# EasyEDA Pro project esp32-v7.epro

# Schematic Schematic1
Board Name: Board1
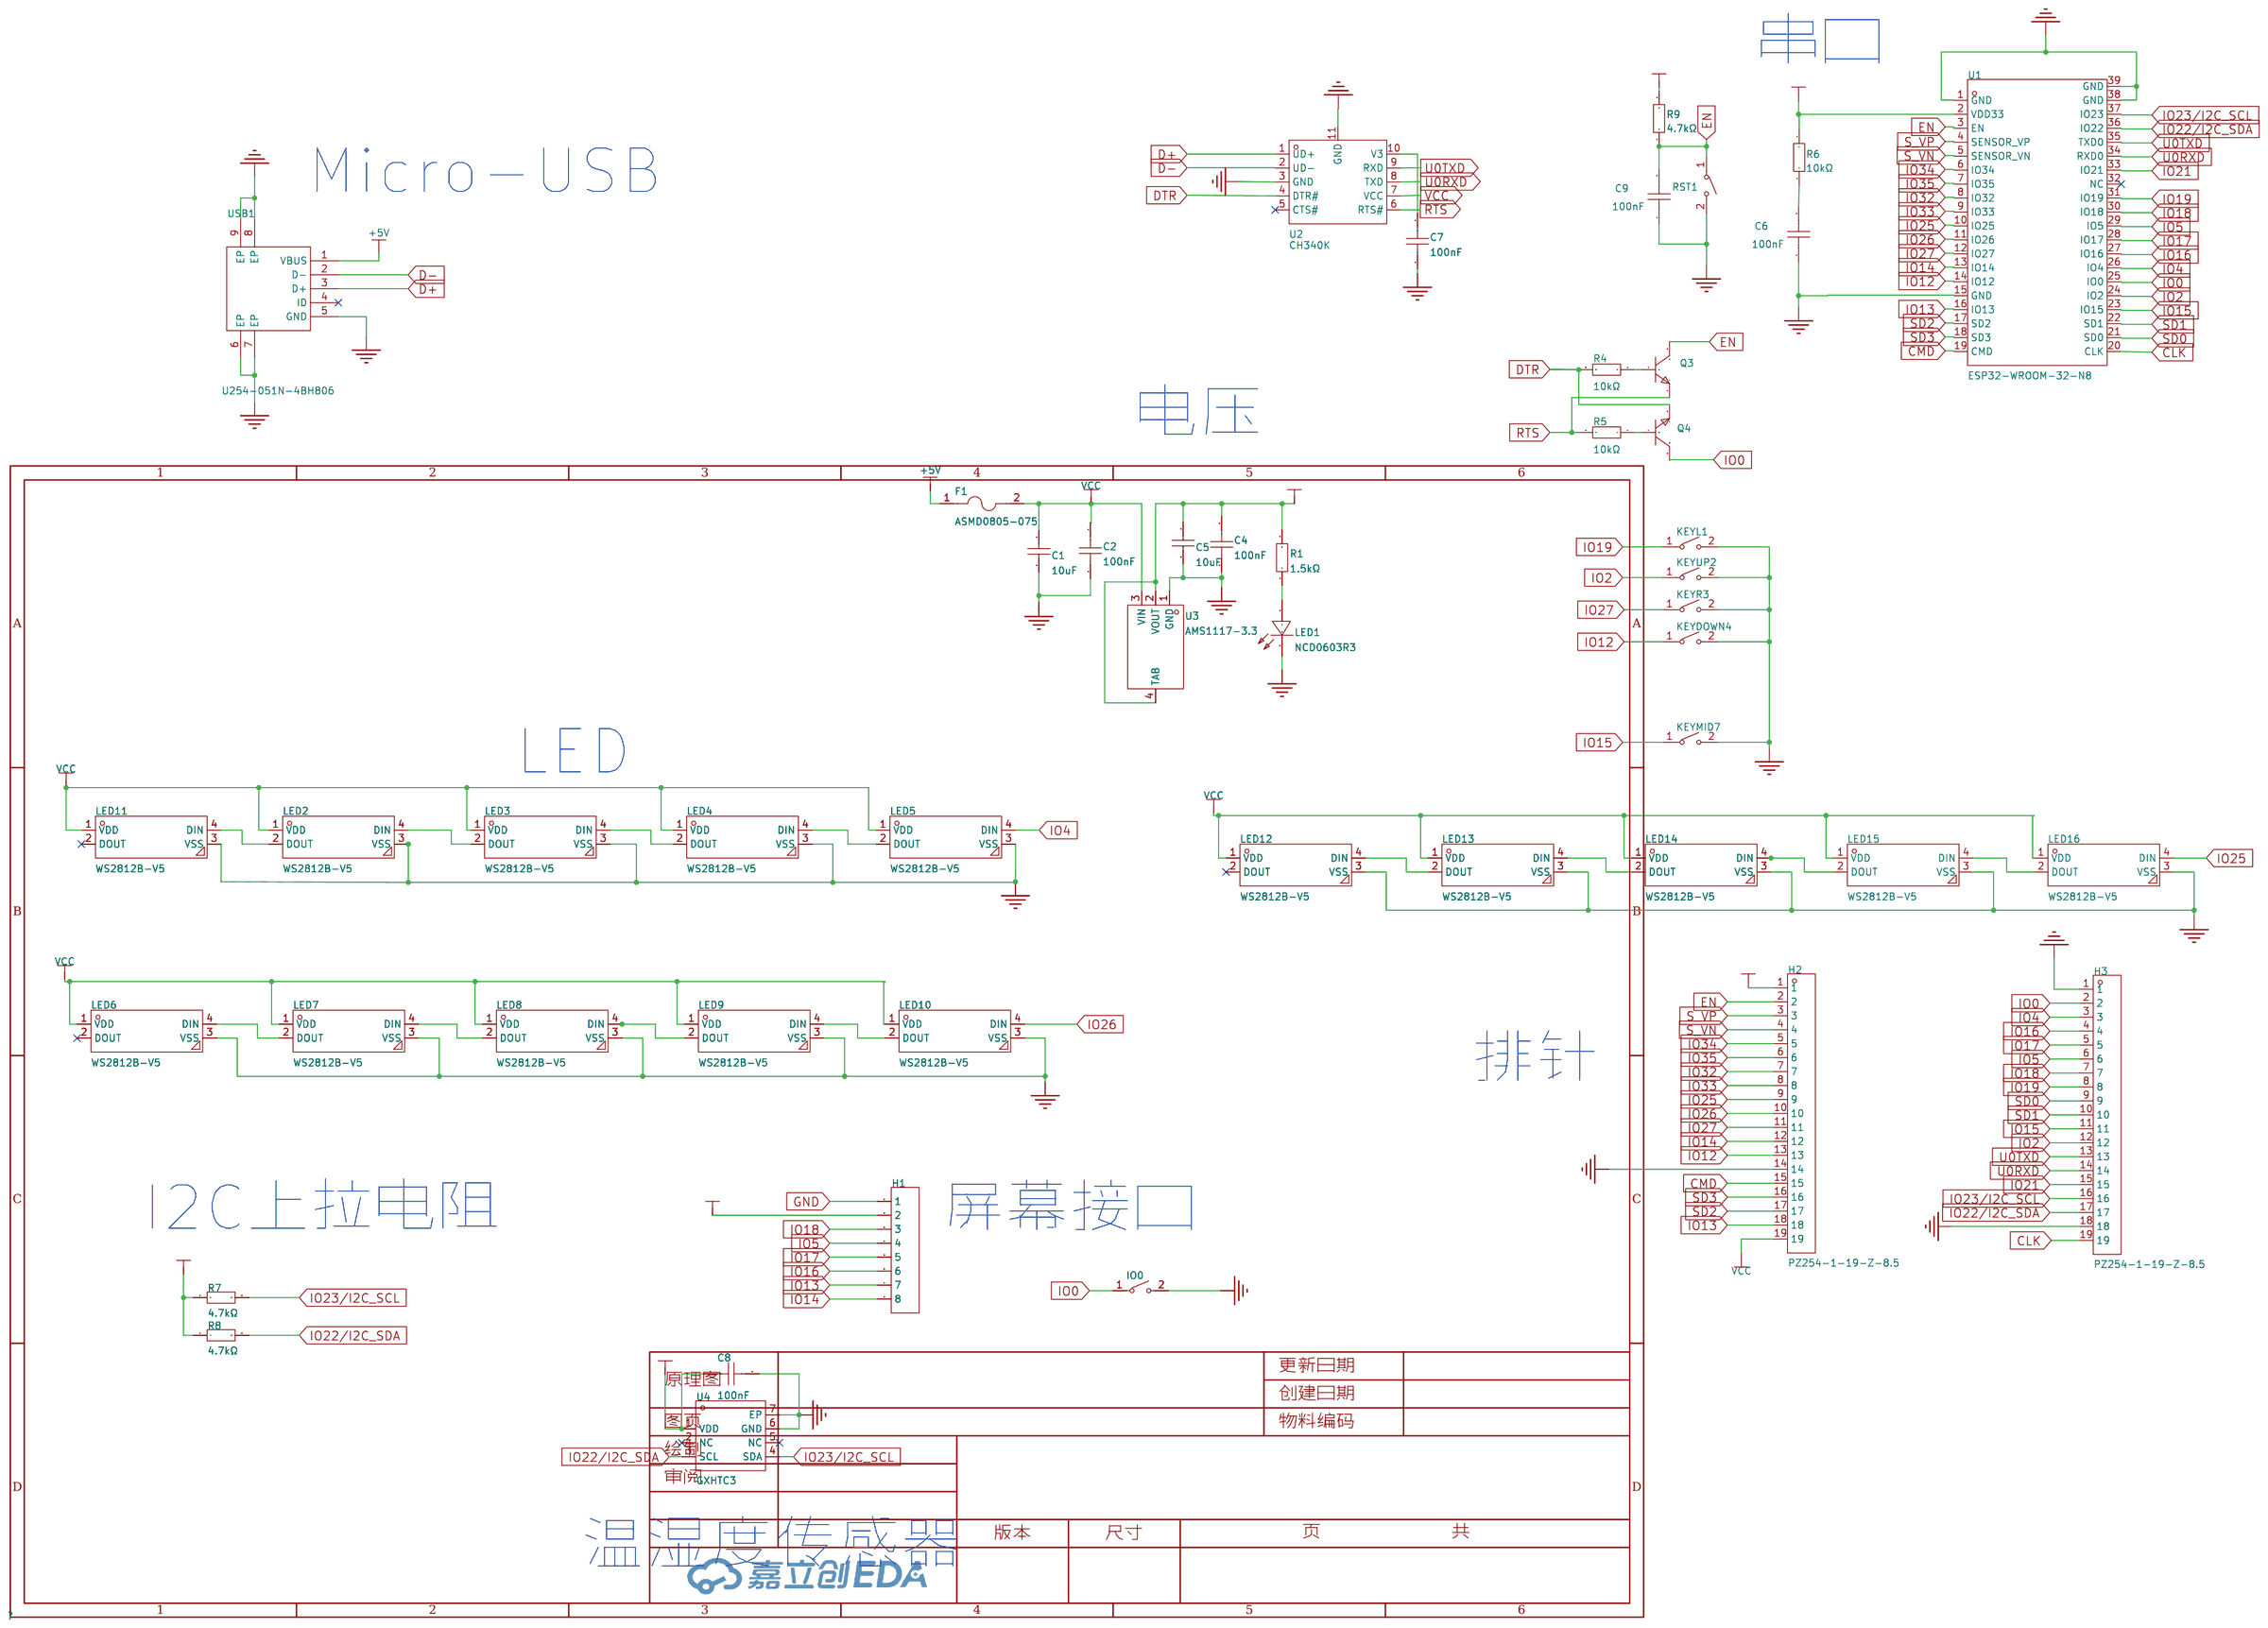
[diagram p0: schematic sheet]

## Parts
C1  10uF  [C0805]
C2  100nF  [C0603]
C4  100nF  [C0603]
C5  10uF  [C0805]
C6  100nF  [C0603]
C7  100nF  [C0603]
C8  100nF  [C0603]
C9  100nF  [C0603]
F1  ASMD0805-075  [F0805]
H1  -  [HDR-TH_8P-P2.54-V-F-1]
H2  PZ254-1-19-Z-8.5  [HDR-TH_19P-P2.54-V-M]
H3  PZ254-1-19-Z-8.5  [HDR-TH_19P-P2.54-V-M]
IO0  TS-1088R-02526  [SW-SMD_L3.9-W3.0-P4.45]
KEYDOWN4  TS-1088R-02526  [SW-SMD_L3.9-W3.0-P4.45]
KEYL1  TS-1088R-02526  [SW-SMD_L3.9-W3.0-P4.45]
KEYMID7  TS-1088R-02526  [SW-SMD_L3.9-W3.0-P4.45]
KEYR3  TS-1088R-02526  [SW-SMD_L3.9-W3.0-P4.45]
KEYUP2  TS-1088R-02526  [SW-SMD_L3.9-W3.0-P4.45]
LED1  NCD0603R3  [LED0603-R-RD_RED]
LED2  WS2812B-V5  [LED-SMD_4P-L5.0-W5.0-LS5.4-TL-1]
LED3  WS2812B-V5  [LED-SMD_4P-L5.0-W5.0-LS5.4-TL-1]
LED4  WS2812B-V5  [LED-SMD_4P-L5.0-W5.0-LS5.4-TL-1]
LED5  WS2812B-V5  [LED-SMD_4P-L5.0-W5.0-LS5.4-TL-1]
LED6  WS2812B-V5  [LED-SMD_4P-L5.0-W5.0-LS5.4-TL-1]
LED7  WS2812B-V5  [LED-SMD_4P-L5.0-W5.0-LS5.4-TL-1]
LED8  WS2812B-V5  [LED-SMD_4P-L5.0-W5.0-LS5.4-TL-1]
LED9  WS2812B-V5  [LED-SMD_4P-L5.0-W5.0-LS5.4-TL-1]
LED10  WS2812B-V5  [LED-SMD_4P-L5.0-W5.0-LS5.4-TL-1]
LED11  WS2812B-V5  [LED-SMD_4P-L5.0-W5.0-LS5.4-TL-1]
LED12  WS2812B-V5  [LED-SMD_4P-L5.0-W5.0-LS5.4-TL-1]
LED13  WS2812B-V5  [LED-SMD_4P-L5.0-W5.0-LS5.4-TL-1]
LED14  WS2812B-V5  [LED-SMD_4P-L5.0-W5.0-LS5.4-TL-1]
LED15  WS2812B-V5  [LED-SMD_4P-L5.0-W5.0-LS5.4-TL-1]
LED16  WS2812B-V5  [LED-SMD_4P-L5.0-W5.0-LS5.4-TL-1]
Q3  L8050QLT1G  [SOT-23-3_L2.9-W1.3-P1.90-LS2.4-BR]
Q4  L8050QLT1G  [SOT-23-3_L2.9-W1.3-P1.90-LS2.4-BR]
R1  1.5kΩ  [R0805]
R4  10kΩ  [R0603]
R5  10kΩ  [R0603]
R6  10kΩ  [R0603]
R7  4.7kΩ  [R0805]
R8  4.7kΩ  [R0805]
R9  4.7kΩ  [R0805]
RST1  TS-1088R-02526  [SW-SMD_L3.9-W3.0-P4.45]
U1  ESP32-WROOM-32-N8  [WIFIM-SMD_39P-L25.5-W18.0-P1.27]
U2  CH340K  [ESOP-10_L4.9-W3.9-P1.00-LS6.0-BL-EP]
U3  AMS1117-3.3  [SOT-223-3_L6.5-W3.4-P2.30-LS7.0-BR]
U4  GXHTC3  [DFN-6_L2.0-W2.0-P0.50-BL-EP]
USB1  U254-051N-4BH806  [MICRO-USB-SMD_U254-051N-4BH806]

## Library data of the parts
C1 C5 = CL21A106KOQNNNE: 容值:10uF;精度:±10%;额定电压:16V;材质(温度系数):X5R;; LCSC Part Name: 10uF ±10% 16V; Supplier Part: C1713; Manufacturer: SAMSUNG(三星); Supplier Footprint: 0805; JLCPCB Part Class: 扩展库; Datasheet: https://atta.szlcsc.com/upload/public/pdf/source/20160218/1457707763339.pdf; Supplier: LCSC; Tolerance: ±10%; Voltage Rated: 16V; Temperature Coefficient: X5R; Check: true
C2 C4 C6-C9 = CC0603KRX7R9BB104: 容值:100nF;精度:±10%;额定电压:50V;材质(温度系数):X7R;; LCSC Part Name: 100nF ±10% 50V; Supplier Part: C14663; Manufacturer: YAGEO(国巨); Supplier Footprint: 0603; JLCPCB Part Class: 基础库; Datasheet: https://atta.szlcsc.com/upload/public/pdf/source/20180910/C282072_33301C7F631E79921B82A8DAC6BCC5B3.pdf; Supplier: LCSC; Tolerance: ±10%; Voltage Rated: 50V; Temperature Coefficient: X7R; Check: true
F1 = ASMD0805-075: 最大电压:6V;最大电流:40A;保持电流:750mA;跳闸电流:1.5A;; LCSC Part Name: 6V 750mA 0805自恢复; Supplier Part: C135330; Manufacturer: JDTfuse(集电通); Supplier Footprint: 0805; JLCPCB Part Class: 扩展库; Datasheet: https://atta.szlcsc.com/upload/public/pdf/source/20230515/CC6FBEFAAD08EE936C05ACEA13E8EAD9.pdf; Supplier: LCSC; Operating Voltage (Max): 6V; Current Rating (Max): 40A; Hold Current: 750mA; Trip Current: 1.5A; Power Dissipation: 600mW; Resistance - Initial (Ri) (Min): 90mΩ; Resistance - Post Trip (R1) (Max): 385mΩ; Maximum Time to Trip: 200ms; Operating Temperature: -40℃~+85℃; Check: true
H1 = HDR-F_2.54_1x8P: Supplier Part: C27438; Supplier Footprint: 插件; JLCPCB Part Class: 扩展库; Check: true
H2 H3 = PZ254-1-19-Z-8.5_C2894942: 插针结构:1x19P;间距:2.54mm;行距:-;圆针/方针:方针;安装类型:直插;排数:单排;总PIN位数:19P;额定电流:3A;额定电压:-;配合针长度:6mm;塑高:2.5mm;端接针长度:3mm;触头材质:黄铜;工作温度范围:-40℃~+105℃;焊接温度(最大值):260℃@10S;颜色:黑色;; LCSC Part Name: 1x19P 间距:2.54mm 方针 直插; Supplier Part: C2894942; Manufacturer: HCTL(华灿天禄); Supplier Footprint: 插件,P=2.54mm; JLCPCB Part Class: 扩展库; Datasheet: https://atta.szlcsc.com/upload/public/pdf/source/20240305/0F0A2A5C422E5D195558C9C26715A031.pdf; Supplier: LCSC; Pin Structure: 1x19P; Pitch: 2.54mm; Circluar Pins/Square Pins: 方针; Mounting Type: 直插; Number of Rows: 单排; Number of Pins: 19P; Current Rating (Max): 3A; Length of Mating Pin: 6mm; Insulation Height: 2.5mm; Length of End Connection Pin: 3mm; Contact Material: 黄铜; Operating Temperature Range: -40℃~+105℃; Soldering Temperature(Max): 260℃@10S; Color: 黑色; Check: true
IO0 KEYDOWN4 KEYL1 KEYMID7 KEYR3 KEYUP2 RST1 = TS-1088R-02526: 电路结构:单刀单掷;按钮形状:圆形按钮;安装方式:立贴;开关长度:3.9mm;开关宽度:2.93mm;开关高度:2.5mm;触点电流:50mA;额定电压(DC):12V;带灯:-;机械寿命:-;; LCSC Part Name: 3.9*2.93*2.5mm 立贴 轻触开关; Supplier Part: C455281; Manufacturer: XUNPU(讯普); Supplier Footprint: SMD,3x4mm; JLCPCB Part Class: 扩展库; Datasheet: https://atta.szlcsc.com/upload/public/pdf/source/20191118/C455281_EC5379764BC1462550DF64BBBFEA9579.pdf; Supplier: LCSC; Circuit: 单刀单掷; Actuator Style: 圆形按钮; Mounting Style: 立贴; Switch Length: 3.9mm; Switch Width: 2.93mm; Switch Height: 2.5mm; Contact Current: 50mA; Voltage Rating (DC): 12V; Check: true
LED1 = NCD0603R3: 发光颜色:红色;正向电压(VF):1.6V~2.6V;功率:65mW;正向电流:25mA;主波长:620nm~640nm;透镜颜色:无色透明透镜;发光强度:51mcd~150mcd;发光角度:130°;工作温度:-30℃~+85℃;; Supplier Part: C3151730; Manufacturer: 国星光电; Supplier Footprint: 0603; JLCPCB Part Class: 扩展库; Datasheet: https://atta.szlcsc.com/upload/public/pdf/source/20220704/CBFF28C1847A97213A75929E60B7DDE7.pdf; Supplier: LCSC; Emitted Color: 红色; Forward Voltage (VF): 1.6V~2.6V; Power Dissipation: 65mW; Forward Current: 25mA; Dominant Wavelength: 620nm~640nm; Peak Wavelength: 640nm; Lens Color: 无色透明透镜; Luminous Intensity: 51mcd~150mcd; Viewing Angle: 130°; Operating Temperature: -30℃~+85℃; Check: true
LED2-LED16 = WS2812B-V5_C2846931: （注意防潮，请查阅规格书中对应具体内容）; Supplier Part: C2846931; Manufacturer: worldsemi; Supplier Footprint: SMD5050; JLCPCB Part Class: 扩展库; Datasheet: https://atta.szlcsc.com/upload/public/pdf/source/20211224/E1D51490BF3990BC3747CA833459C67A.pdf; Supplier: LCSC; Check: true
Q3 Q4 = L8050QLT1G: 晶体管类型:NPN;集电极电流(Ic):800mA;集射极击穿电压(Vceo):25V;功率(Pd):225mW;; LCSC Part Name: 耐压:25V 电流:800mA NPN; Supplier Part: C49581; Manufacturer: LRC(乐山无线电); Supplier Footprint: SOT-23; JLCPCB Part Class: 扩展库; Datasheet: https://atta.szlcsc.com/upload/public/pdf/source/20150518/1457707314424.pdf; Supplier: LCSC; Transistor Type: NPN; Collector Current (Ic): 800mA; Collector-Emitter Breakdown Voltage (Vceo): 25V; Power Dissipation (Pd): 225mW; Check: true
R1 = 0805W8F1501T5E: 电阻类型:厚膜电阻;阻值:1.5kΩ;精度:±1%;功率:125mW;最大工作电压:150V;温度系数:±100ppm/℃;; LCSC Part Name: 1.5kΩ ±1% 125mW 厚膜电阻; Supplier Part: C4310; Manufacturer: UNI-ROYAL(厚声); Supplier Footprint: 0805; JLCPCB Part Class: 基础库; Datasheet: https://atta.szlcsc.com/upload/public/pdf/source/20200306/C422600_1E6D84923E4A46A82E41ADD87F860B5C.pdf; Supplier: LCSC; Type: 厚膜电阻; Tolerance: ±1%; Power(Watts): 125mW; Overload Voltage (Max): 150V; Temperature Coefficient: ±100ppm/℃; Operating Temperature Range: -55℃~+155℃; Check: true
R4-R6 = TR0603B10K0P0525Z: 电阻类型:薄膜电阻;阻值:10kΩ;精度:±0.1%;功率:100mW;温度系数:±25ppm/;最大工作电压:75V;工作温度范围:-55~+155;; LCSC Part Name: 10kΩ ±0.1% 100mW; Supplier Part: C188363; Manufacturer: EVER OHMS(天二科技); Supplier Footprint: 0603; JLCPCB Part Class: Extended Part; Datasheet: https://atta.szlcsc.com/upload/public/pdf/source/20190415/C188363_433BF05B6FB8F7A0F5F35A3E4390C55A.pdf; Supplier: LCSC; Type: 薄膜电阻; Tolerance: ±0.1%; Power(Watts): 100mW; Temperature Coefficient: ±25ppm/; Overload Voltage (Max): 75V; Operating Temperature Range: -55~+155; Check: true
R7-R9 = 0805W8F4701T5E: 电阻类型:厚膜电阻;阻值:4.7kΩ;精度:±1%;功率:125mW;最大工作电压:150V;温度系数:±100ppm/℃;; LCSC Part Name: 4.7kΩ ±1% 125mW 厚膜电阻; Supplier Part: C17673; Manufacturer: UNI-ROYAL(厚声); Supplier Footprint: 0805; JLCPCB Part Class: 基础库; Datasheet: https://atta.szlcsc.com/upload/public/pdf/source/20200306/C422600_1E6D84923E4A46A82E41ADD87F860B5C.pdf; Supplier: LCSC; Type: 厚膜电阻; Tolerance: ±1%; Power(Watts): 125mW; Overload Voltage (Max): 150V; Temperature Coefficient: ±100ppm/℃; Operating Temperature Range: -55℃~+155℃; Check: true
U1 = ESP32-WROOM-32-N8: Supplier Part: C529582; Manufacturer: ESPRESSIF(乐鑫); Supplier Footprint: SMD,18x25.5mm; JLCPCB Part Class: 扩展库; Datasheet: https://atta.szlcsc.com/upload/public/pdf/source/20200521/C529581_8F7B9F041ADB7CF235FBC8D159B9C4FF.pdf; Supplier: LCSC; Check: true
U2 = CH340K_C18208922: LCSC Part Name: CH340K 人工转编带; Supplier Part: C18208922; Manufacturer: WCH(南京沁恒); Supplier Footprint: ESSOP-10-150mil-1mm; JLCPCB Part Class: 扩展库; Datasheet: https://atta.szlcsc.com/upload/public/pdf/source/20240313/9D833A30DDFD16C064A7ADE10A944019.pdf; Supplier: LCSC; Check: true
U3 = AMS1117-3.3_C351784: 输出类型:固定;最大输入电压:18V;输出电压:3.3V;最大输出电流:800mA;电源纹波抑制比(PSRR):-;输出极性:正极;; LCSC Part Name: 输入18V 输出3.3V 800mA; Supplier Part: C351784; Manufacturer: PUOLOP(迪浦); Supplier Footprint: SOT-223-3; JLCPCB Part Class: 扩展库; Datasheet: https://atta.szlcsc.com/upload/public/pdf/source/20210915/EA806799CEEC3F52E0A4FA8303A508AC.pdf; Supplier: LCSC; Output Type: 固定; Maximum Input Voltage: 18V; Output Voltage: 3.3V; MAX Output Current: 800mA; Dropout Voltage: 1.4V@(1A); Output Polarity: 正极; Number of Outputs: 1; Check: true
U4 = GXHTC3: GXHTC3C是一款为消费电子应用领域设计的温湿度传感器芯片。它在封装体积、功耗、供电电压范围和性价比方面完全满足消费电子领域需求。GXHTC3在单颗芯片上实现了完整的温湿度传感器系统，包括电容式湿敏传感单元，PN 结测温单元，16位 ADC，数字信号处理电路，校准数据存储单元和I2C数字通信接口电路。; Supplier Part: C2837688; Manufacturer: GXCAS(中科银河芯); Supplier Footprint: DFN-6-EP(2x2); JLCPCB Part Class: 扩展库; Datasheet: https://atta.szlcsc.com/upload/public/pdf/source/20230809/660E95CE3850F3D94BCF8D6A95359493.pdf; Supplier: LCSC; Check: true
USB1 = U254-051N-4BH806: 连接器类型:Micro-B;标准:USB 2.0;公母:母;端口数量:1;触点数量:5P;安装方式:卧贴;额定电流 - 电源:1A;触头材质:铜合金;触头镀层:金;工作温度范围:-40℃~+85℃;焊接温度(最大值):260℃;; LCSC Part Name: Micro-B 母 卧贴; Supplier Part: C319170; Manufacturer: XKB Connectivity(中国星坤); Supplier Footprint: SMD; JLCPCB Part Class: 扩展库; Datasheet: https://atta.szlcsc.com/upload/public/pdf/source/20200227/C319170_F6FB71A4890E6895B9081D2D7B14A58F.pdf; Supplier: LCSC; Connector Type: Micro-B; Standard: USB 2.0; Gender: 母; Number of Ports: 1; Number of Contacts: 5P; Mounting Style: 卧贴; Current Rating - Power (Max): 1A; Contact Material: 铜合金; Contact Plating: 金; Operating Temperature Range: -40℃~+85℃; Soldering Temperature(Max): 260℃

## Nets
3V3: C4.2 C5.2 C8.2 H1.2 H2.1 R1.2 R6.1 R7.1 R8.1 R9.2 U1.2(VDD33) U3.2(VOUT) U3.4(TAB) U4.1(VDD)
+5V: F1.1 USB1.1(VBUS)
GND: C1.1 C2.1 C4.1 C5.1 C6.1 C7.1 C8.1 C9.1 H1.1 H2.14 H3.1 H3.18 IO0.2 KEYDOWN4.2 KEYL1.2 KEYMID7.2 KEYR3.2 KEYUP2.2 LED1.2(K) LED2.3(VSS) LED3.3(VSS) LED4.3(VSS) LED5.3(VSS) LED6.3(VSS) LED7.3(VSS) LED8.3(VSS) LED9.3(VSS) LED10.3(VSS) LED11.3(VSS) LED12.3(VSS) LED13.3(VSS) LED14.3(VSS) LED15.3(VSS) LED16.3(VSS) RST1.2 U1.15(GND) U1.39(GND) U2.3(GND) U2.11(GND) U3.1(GND) U4.6(GND) U4.7(EP) USB1.5(GND) USB1.6(EP) USB1.7(EP) USB1.8(EP) USB1.9(EP)
VCC: C1.2 C2.2 F1.2 H2.19 LED2.1(VDD) LED3.1(VDD) LED4.1(VDD) LED5.1(VDD) LED6.1(VDD) LED7.1(VDD) LED8.1(VDD) LED9.1(VDD) LED10.1(VDD) LED11.1(VDD) LED12.1(VDD) LED13.1(VDD) LED14.1(VDD) LED15.1(VDD) LED16.1(VDD) U2.7(VCC) U3.3(VIN)
CLK: H3.19 U1.20(CLK)
CMD: H2.15 U1.19(CMD)
D+: U2.1(UD+) USB1.3(D+)
D-: USB1.2(D-)
DTR: Q4.2(E) R4.2 U2.4(DTR#)
EN: C9.2 H2.2 Q3.3(C) R9.1 RST1.1 U1.3(EN)
IO0: H3.2 IO0.1 Q4.3(C)
IO2: H3.12 KEYUP2.1
IO4: H3.3 LED5.4(DIN)
IO5: H1.4 H3.6
IO12: H2.13 KEYDOWN4.1 U1.14(IO12)
IO13: H1.7 H2.18 U1.16(IO13)
IO14: H1.8 H2.12 U1.13(IO14)
IO15: H3.11 KEYMID7.1
IO16: H1.6 H3.4
IO17: H1.5 H3.5
IO18: H1.3 H3.7
IO19: H3.8 KEYL1.1
IO21: H3.15
IO22/I2C_SDA: H3.17 R8.2 U4.3(SCL)
IO23/I2C_SCL: H3.16 R7.2 U4.4(SDA)
IO25: H2.9 LED16.4(DIN) U1.10(IO25)
IO26: H2.10 LED10.4(DIN) U1.11(IO26)
IO27: H2.11 KEYR3.1 U1.12(IO27)
IO32: H2.7 U1.8(IO32)
IO33: H2.8 U1.9(IO33)
IO34: H2.5 U1.6(IO34)
IO35: H2.6 U1.7(IO35)
RTS: Q3.2(E) R5.2 U2.6(RTS#)
S_VN: H2.4 U1.5(SENSOR_VN)
S_VP: H2.3 U1.4(SENSOR_VP)
SD0: H3.9
SD1: H3.10
SD2: H2.17 U1.17(SD2)
SD3: H2.16 U1.18(SD3)
U0RXD: H3.14 U2.8(TXD)
U0TXD: H3.13 U2.9(RXD)
$1N3522: Q3.1(B) R4.1
$1N3523: Q4.1(B) R5.1
$1N6190: LED4.4(DIN) LED5.2(DOUT)
$1N6194: LED3.4(DIN) LED4.2(DOUT)
$1N7224: LED2.4(DIN) LED3.2(DOUT)
$1N7332: LED6.4(DIN) LED7.2(DOUT)
$1N7339: LED7.4(DIN) LED8.2(DOUT)
$1N7349: LED8.4(DIN) LED9.2(DOUT)
$1N7358: LED9.4(DIN) LED10.2(DOUT)
$1N7583: C6.2 R6.2
$1N8343: C7.2 U2.10(V3)
$1N10653: LED1.1(A) R1.1
$1N11613: LED14.4(DIN) LED15.2(DOUT)
$1N11617: LED15.4(DIN) LED16.2(DOUT)
$1N11658: LED13.4(DIN) LED14.2(DOUT)
$1N11662: LED12.4(DIN) LED13.2(DOUT)

Not connected (* = marked no-connect by the designer): LED2 2(DOUT); LED6 2(DOUT)*; LED11 2(DOUT)* 4(DIN); LED12 2(DOUT)*; U1 1(GND) 21(SD0) 22(SD1) 23(IO15) 24(IO2) 25(IO0) 26(IO4) 27(IO16) 28(IO17) 29(IO5) 30(IO18) 31(IO19) 32(NC)* 33(IO21) 34(RXD0) 35(TXD0) 36(IO22) 37(IO23) 38(GND); U2 2(UD-) 5(CTS#)*; U4 2(NC)* 5(NC)*; USB1 4(ID)*

## Notes on the sheet
- 串口
- Micro-USB
- 电压
- LED
- 排针
- I2C上拉电阻
- 屏幕接口
- 温湿度传感器

# Board PCB1
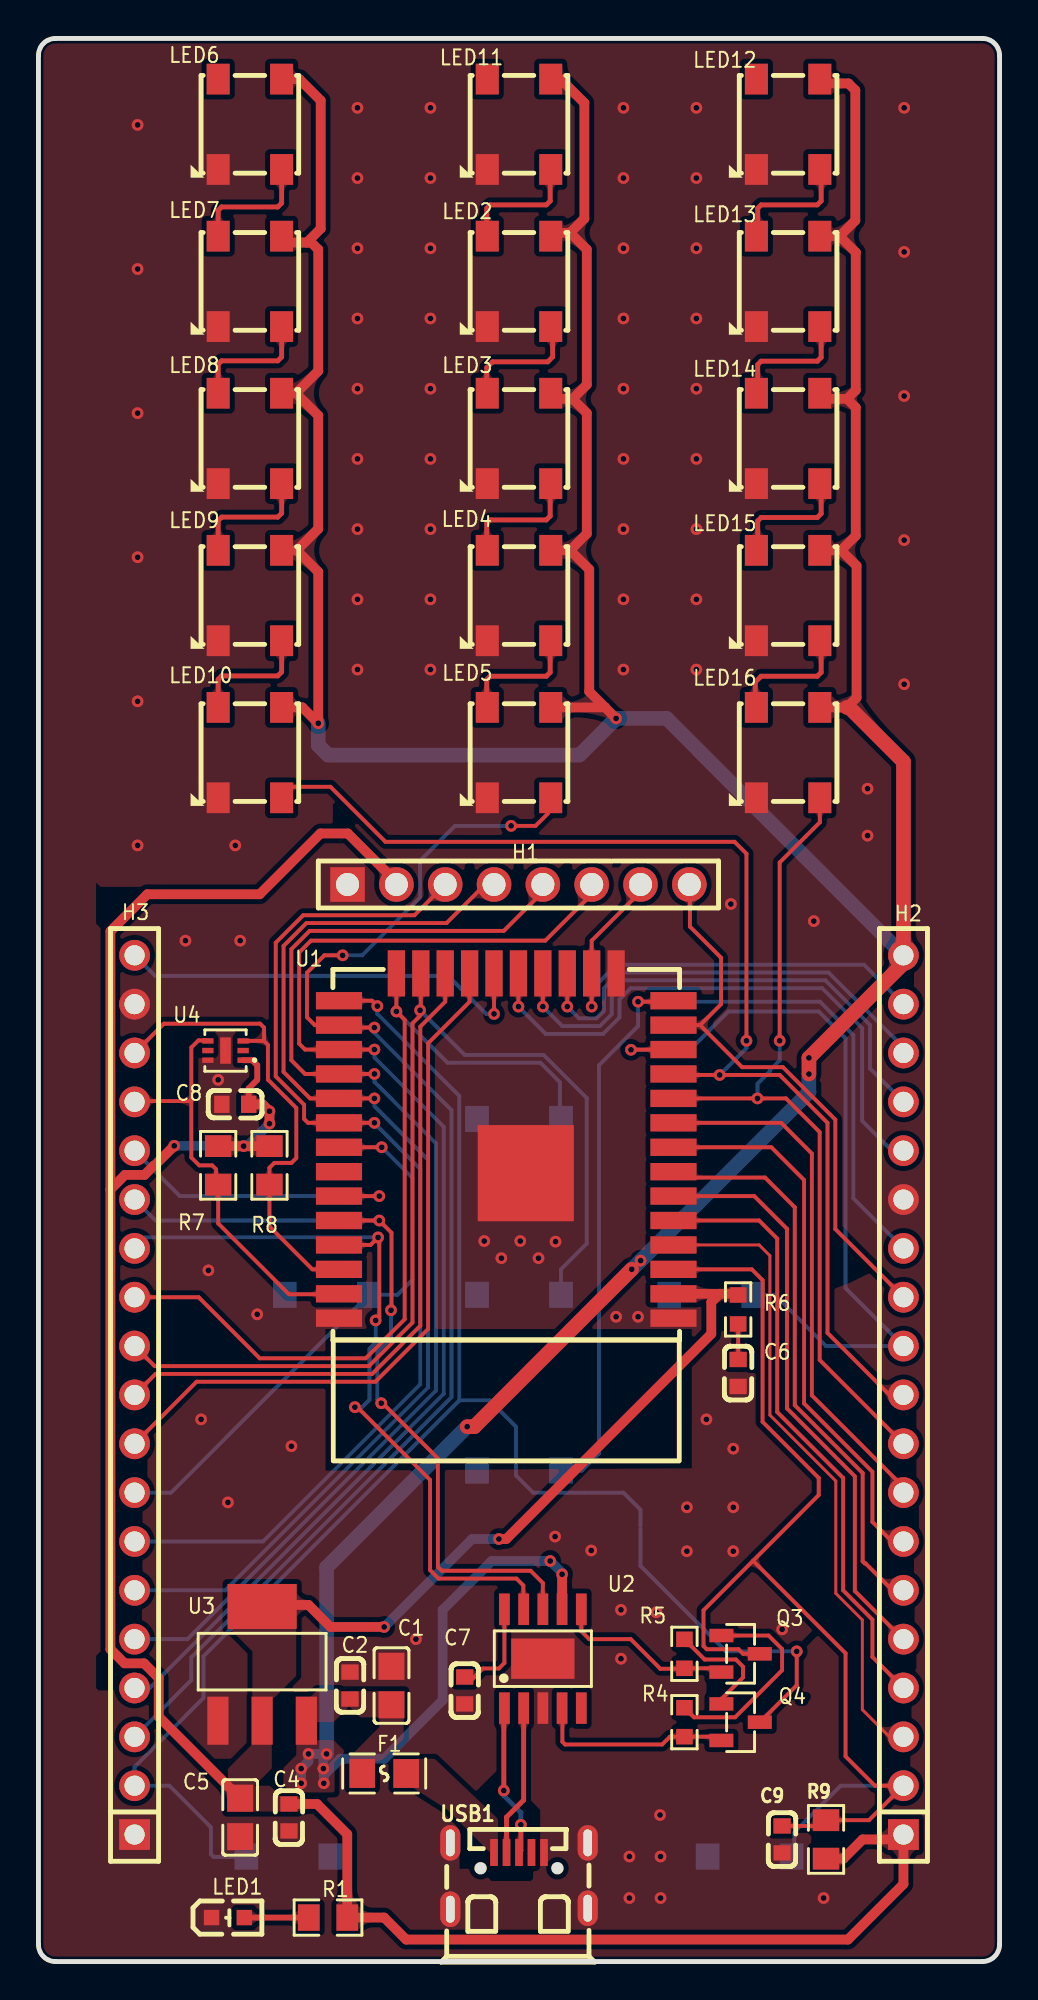
[diagram p1: board, top side]
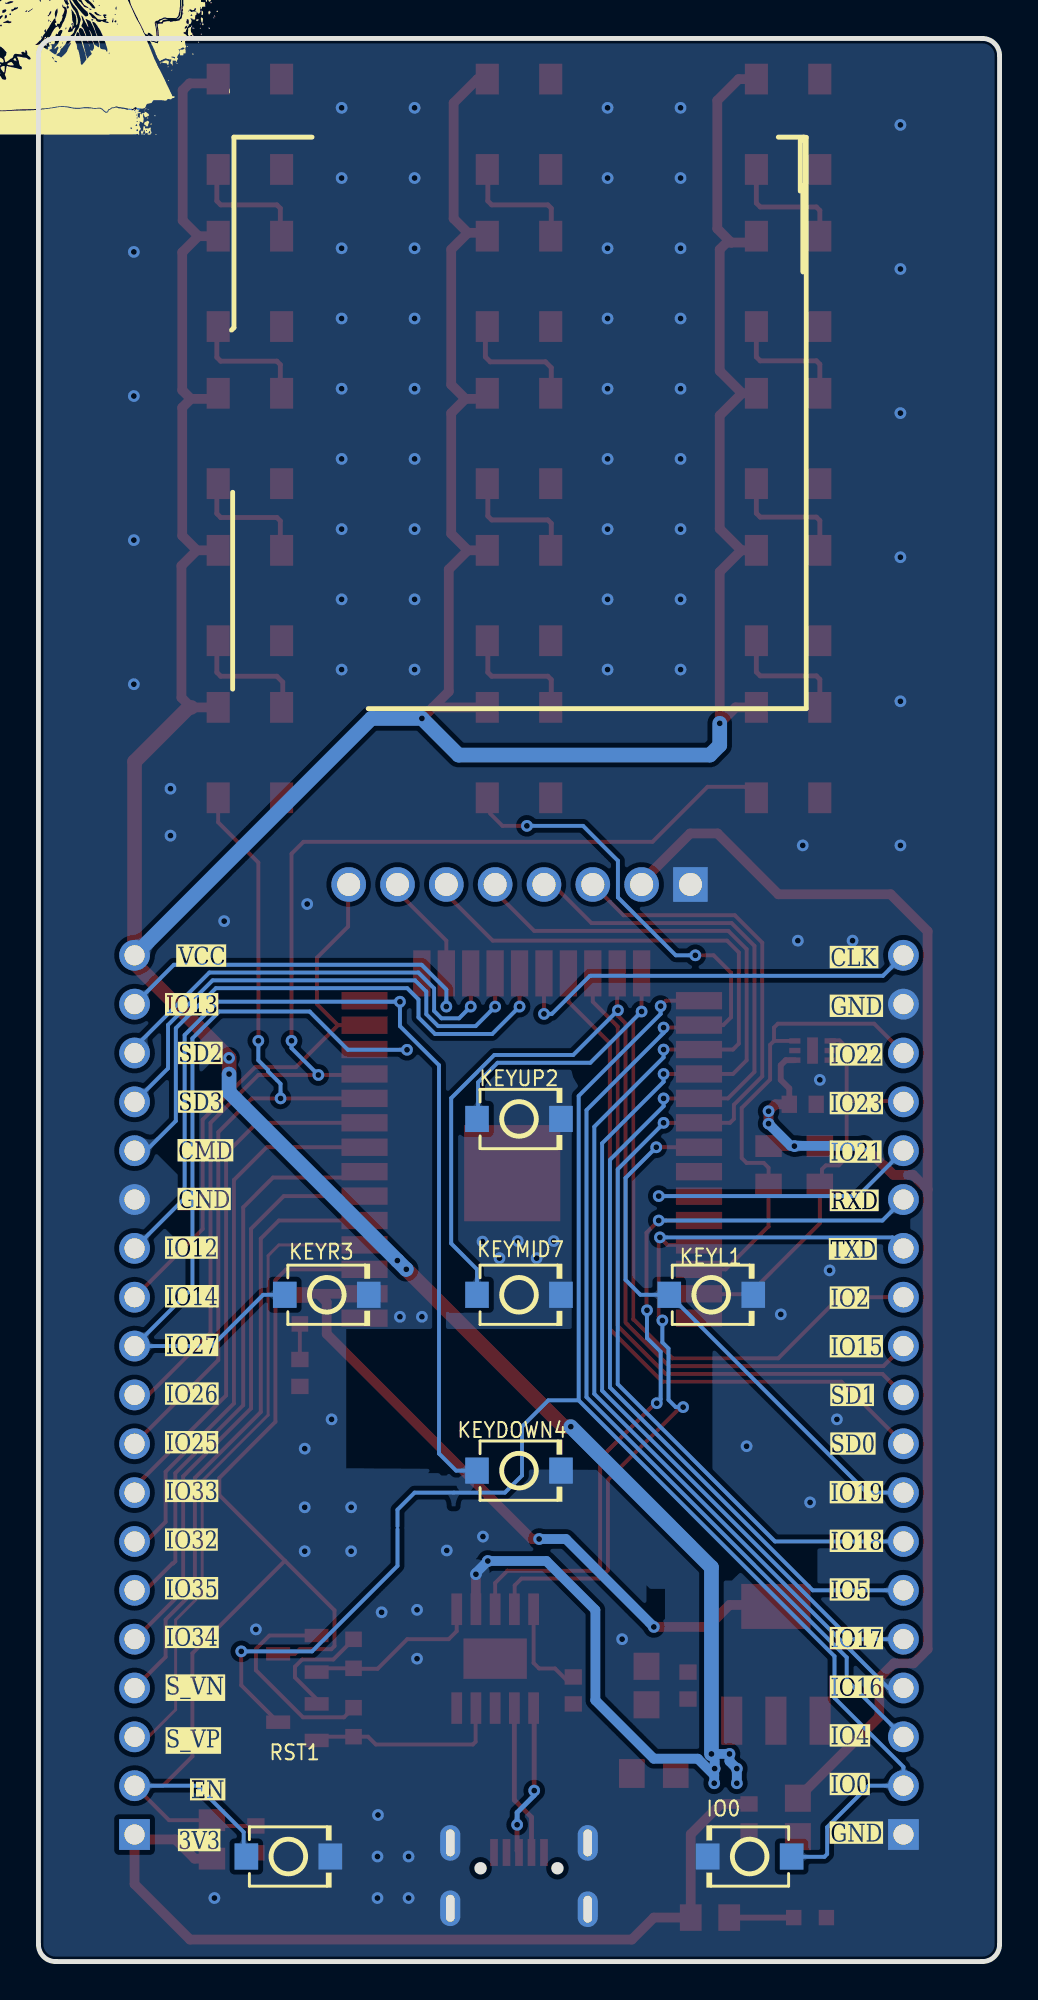
[diagram p2: board, bottom side, seen from below]

Outline 50 x 100 mm; copper layers: Top Layer, Bottom Layer. Coordinates in mm from the lower left corner of the outline.
Outline path: 0,99.11 arc(0.26,99.74) 0.89,100 49.11,100 arc(49.74,99.74) 50,99.11 50,0.89 arc(49.74,0.26) 49.11,0 0.89,0 arc(0.26,0.26) 0,0.89 0,99.11
Stack: Top Layer 0.035mm / Dielectric1 1.51mm FR4 er 4.5 / Bottom Layer 0.035mm

## Design rules (mm)
net VCC: power
net GND: power
net 3V3: power
net +5V: power
net D+: DP1
net D-: DP1
template: 自定义配置
spacing copperThickness1oz (default): track to track 0.203, other pairs 0.152 to 0.203
spacing copperThickness2oz: track to track 0.203, other pairs 0.152 to 0.3
track width copperThickness1oz (default): min 0.152, default 0.203, max 0.508
track width copperThickness2oz: min 0.203, default 0.254, max 2.54
track width power: min 0.305, default 0.508, max 0.762
differential pair differentialPair (default): width min 0.127, default 0.254, max 2.54; gap min 0.152, default 0.152
via viaSize (default): diameter min 0.61, default 0.61, max 0.61; hole min 0.305, default 0.305, max 0.305
net class power uses power
net VCC uses power
net GND uses power
net 3V3 uses power
net +5V uses power

## Placement (name value [footprint] x y rotation side)
C1  10uF  [C0805]  18.37 14.35 270 top
C2  100nF  [C0603]  16.21 14.35 270 top
C4  100nF  [C0603]  13.03 7.49 90 top
C5  10uF  [C0805]  10.49 7.49 90 top
C6  100nF  [C0603]  36.4 30.61 90 top
C7  100nF  [C0603]  22.18 14.1 90 top
C8  100nF  [C0603]  10.24 44.58 0 top
C9  100nF  [C0603]  38.69 6.35 90 top
F1  ASMD0805-075  [F0805]  17.99 9.78 180 top
H1  -  [HDR-TH_8P-P2.54-V-F-1]  24.97 56.01 0 top
H2  PZ254-1-19-Z-8.5  [HDR-TH_19P-P2.54-V-M]  45 29.46 90 top
H3  PZ254-1-19-Z-8.5  [HDR-TH_19P-P2.54-V-M]  5 29.46 90 top
IO0  TS-1088R-02526  [SW-SMD_L3.9-W3.0-P4.45]  13 5.46 0 bottom
KEYDOWN4  TS-1088R-02526  [SW-SMD_L3.9-W3.0-P4.45]  25 25.53 180 bottom
KEYL1  TS-1088R-02526  [SW-SMD_L3.9-W3.0-P4.45]  15 34.67 180 bottom
KEYMID7  TS-1088R-02526  [SW-SMD_L3.9-W3.0-P4.45]  25 34.67 180 bottom
KEYR3  TS-1088R-02526  [SW-SMD_L3.9-W3.0-P4.45]  35 34.67 180 bottom
KEYUP2  TS-1088R-02526  [SW-SMD_L3.9-W3.0-P4.45]  25 43.81 180 bottom
LED1  NCD0603R3  [LED0603-R-RD_RED]  9.86 2.29 0 top
LED2  WS2812B-V5  [LED-SMD_4P-L5.0-W5.0-LS5.4-TL-1]  25 87.37 270 top
LED3  WS2812B-V5  [LED-SMD_4P-L5.0-W5.0-LS5.4-TL-1]  25 79.2 270 top
LED4  WS2812B-V5  [LED-SMD_4P-L5.0-W5.0-LS5.4-TL-1]  25 71.03 270 top
LED5  WS2812B-V5  [LED-SMD_4P-L5.0-W5.0-LS5.4-TL-1]  25 62.86 270 top
LED6  WS2812B-V5  [LED-SMD_4P-L5.0-W5.0-LS5.4-TL-1]  11 95.54 270 top
LED7  WS2812B-V5  [LED-SMD_4P-L5.0-W5.0-LS5.4-TL-1]  11 87.37 270 top
LED8  WS2812B-V5  [LED-SMD_4P-L5.0-W5.0-LS5.4-TL-1]  11 79.2 270 top
LED9  WS2812B-V5  [LED-SMD_4P-L5.0-W5.0-LS5.4-TL-1]  11 71.03 270 top
LED10  WS2812B-V5  [LED-SMD_4P-L5.0-W5.0-LS5.4-TL-1]  11 62.86 270 top
LED11  WS2812B-V5  [LED-SMD_4P-L5.0-W5.0-LS5.4-TL-1]  25 95.54 270 top
LED12  WS2812B-V5  [LED-SMD_4P-L5.0-W5.0-LS5.4-TL-1]  39 95.54 270 top
LED13  WS2812B-V5  [LED-SMD_4P-L5.0-W5.0-LS5.4-TL-1]  39 87.37 270 top
LED14  WS2812B-V5  [LED-SMD_4P-L5.0-W5.0-LS5.4-TL-1]  39 79.2 270 top
LED15  WS2812B-V5  [LED-SMD_4P-L5.0-W5.0-LS5.4-TL-1]  39 71.03 270 top
LED16  WS2812B-V5  [LED-SMD_4P-L5.0-W5.0-LS5.4-TL-1]  39 62.86 270 top
Q3  L8050QLT1G  [SOT-23-3_L2.9-W1.3-P1.90-LS2.4-BR]  36.53 16 180 top
Q4  L8050QLT1G  [SOT-23-3_L2.9-W1.3-P1.90-LS2.4-BR]  36.53 12.45 180 top
R1  1.5kΩ  [R0805]  15.06 2.29 0 top
R4  10kΩ  [R0603]  33.61 12.45 270 top
R5  10kΩ  [R0603]  33.61 16 270 top
R6  10kΩ  [R0603]  36.4 33.91 270 top
R7  4.7kΩ  [R0805]  9.35 41.4 270 top
R8  4.7kΩ  [R0805]  12.02 41.4 270 top
R9  4.7kΩ  [R0805]  40.97 6.35 270 top
RST1  TS-1088R-02526  [SW-SMD_L3.9-W3.0-P4.45]  37 5.46 180 bottom
U1  ESP32-WROOM-32-N8  [WIFIM-SMD_39P-L25.5-W18.0-P1.27]  24.34 42.42 180 top
U2  CH340K  [ESOP-10_L4.9-W3.9-P1.00-LS6.0-BL-EP]  26.24 15.75 0 top
U3  AMS1117-3.3  [SOT-223-3_L6.5-W3.4-P2.30-LS7.0-BR]  11.64 15.49 270 top
U4  GXHTC3  [DFN-6_L2.0-W2.0-P0.50-BL-EP]  9.73 47.37 90 top
USB1  U254-051N-4BH806  [MICRO-USB-SMD_U254-051N-4BH806]  25 4.44 0 top

## Footprints (pads in the part's own frame, mm; a bottom-side part is the same pattern mirrored in y, then rotated)
C0603
  rect 0.8x0.9 smd: 1(-0.7,0) 2(0.7,0)
C0805
  rect 1.41x1.35 smd: 1(-1,0) 2(1,0)
DFN-6_L2.0-W2.0-P0.50-BL-EP
  rect 0.28x0.585 smd: 1(-0.5,-0.917) 2(0,-0.917) 3(0.5,-0.917) 4(0.5,0.917) 5(0,0.917) 6(-0.5,0.917)
  rect 1.37x0.56 smd: 7(0,0)
ESOP-10_L4.9-W3.9-P1.00-LS6.0-BL-EP
  rect 0.56x1.64 smd: 1(-2,-2.57) 2(-1,-2.57) 3(0,-2.57) 4(1,-2.57) 5(2,-2.57) 6(2,2.57) 7(1,2.57) 8(0,2.57) 9(-1,2.57) 10(-2,2.57)
  rect 3.3x2.1 smd: 11(0,0)
F0805
  rect 1.335x1.5 smd: 1(-1.143,0) 2(1.143,0)
HDR-TH_8P-P2.54-V-F-1
  rect 1.8x1.8 hole 1.2: 1(-8.89,0)
  round 1.8 hole 1.2: 2(-6.35,0) 3(-3.81,0) 4(-1.27,0) 5(1.27,0) 6(3.81,0) 7(6.35,0) 8(8.89,0)
HDR-TH_19P-P2.54-V-M
  rect 1.6x1.6 hole 1.05: 1(-22.86,0)
  round 1.6 hole 1.05: 2(-20.32,0) 3(-17.78,0) 4(-15.24,0) 5(-12.7,0) 6(-10.16,0) 7(-7.62,0) 8(-5.08,0) 9(-2.54,0) 10(0,0) 11(2.54,0) 12(5.08,0) 13(7.62,0) 14(10.16,0) 15(12.7,0) 16(15.24,0) 17(17.78,0) 18(20.32,0) 19(22.86,0)
LED0603-R-RD_RED
  rect 0.8x0.8 smd: 1(0.851,0) 2(-0.851,0)
LED-SMD_4P-L5.0-W5.0-LS5.4-TL-1
  rect 1.6x1.2 smd: 1(-2.35,1.65) 2(-2.35,-1.65) 3(2.35,-1.65) 4(2.35,1.65)
MICRO-USB-SMD_U254-051N-4BH806
  rect 0.4x1.4 smd: 1(-1.3,1.225) 2(-0.65,1.225) 3(0,1.225) 4(0.65,1.225) 5(1.3,1.225)
  oval 1.05x1.85 hole 0.45x1.4: 6(-3.575,1.725) 7(-3.575,-1.725) 8(3.575,1.725) 9(3.575,-1.675)
R0603
  rect 0.806x0.864 smd: 1(-0.753,0) 2(0.753,0)
R0805
  rect 1.133x1.377 smd: 1(-1,0) 2(1,0)
SOT-23-3_L2.9-W1.3-P1.90-LS2.4-BR
  rect 1.25x0.7 smd: 1(1,-0.95) 2(1,0.95) 3(-1,0)
SOT-223-3_L6.5-W3.4-P2.30-LS7.0-BR
  rect 2.5x1.1 smd: 1(2.97,-2.3) 2(2.97,0) 3(2.97,2.3)
  rect 2.34x3.6 smd: 4(-2.97,0)
SW-SMD_L3.9-W3.0-P4.45
  rect 1.23x1.36 smd: 1(-2.185,0) 2(2.185,0)
WIFIM-SMD_39P-L25.5-W18.0-P1.27
  rect 2.4x0.9 smd: 1(-8.7,8.965) 2(-8.7,7.695) 3(-8.7,6.425) 4(-8.7,5.155) 5(-8.7,3.885) 6(-8.7,2.615) 7(-8.7,1.345) 8(-8.7,0.075) 9(-8.7,-1.195) 10(-8.7,-2.465) 11(-8.7,-3.735) 12(-8.7,-5.005) 13(-8.7,-6.275) 14(-8.7,-7.545) 25(8.7,-7.545) 26(8.7,-6.275) 27(8.7,-5.005) 28(8.7,-3.735) 29(8.7,-2.465) 30(8.7,-1.195) 31(8.7,0.075) 32(8.7,1.345) 33(8.7,2.615) 34(8.7,3.885) 35(8.7,5.155) 36(8.7,6.425) 37(8.7,7.695) 38(8.7,8.965)
  rect 0.9x2.4 smd: 15(-5.715,-8.965) 16(-4.445,-8.965) 17(-3.175,-8.965) 18(-1.905,-8.965) 19(-0.635,-8.965) 20(0.635,-8.965) 21(1.905,-8.965) 22(3.175,-8.965) 23(4.445,-8.965) 24(5.715,-8.965)
  rect 5x5 smd: 39(-1.017,1.422)

## Nets
3V3: C4.2 C5.2 C8.2 H1.2 H2.1 R1.2 R6.1 R7.1 R8.1 R9.2 U1.2 U3.2 U3.4 U4.1
+5V: F1.1 USB1.1
GND: C1.1 C2.1 C4.1 C5.1 C6.1 C7.1 C8.1 C9.1 H1.1 H2.14 H3.1 H3.18 IO0.2 KEYDOWN4.2 KEYL1.2 KEYMID7.2 KEYR3.2 KEYUP2.2 LED1.2 LED2.3 LED3.3 LED4.3 LED5.3 LED6.3 LED7.3 LED8.3 LED9.3 LED10.3 LED11.3 LED12.3 LED13.3 LED14.3 LED15.3 LED16.3 RST1.2 U1.1 U1.15 U1.38 U1.39 U2.3 U2.11 U3.1 U4.6 U4.7 USB1.5 USB1.6 USB1.7 USB1.8 USB1.9
VCC: C1.2 C2.2 F1.2 H2.19 LED2.1 LED3.1 LED4.1 LED5.1 LED6.1 LED7.1 LED8.1 LED9.1 LED10.1 LED11.1 LED12.1 LED13.1 LED14.1 LED15.1 LED16.1 U2.7 U3.3
CLK: H3.19 U1.20
CMD: H2.15 U1.19
D+: U2.1 USB1.3
D-: U2.2 USB1.2
DTR: Q4.2 R4.2 U2.4
EN: C9.2 H2.2 Q3.3 R9.1 RST1.1 U1.3
IO0: H3.2 IO0.1 Q4.3 U1.25
IO2: H3.12 KEYUP2.1 U1.24
IO4: H3.3 LED5.4 U1.26
IO5: H1.4 H3.6 U1.29
IO12: H2.13 KEYDOWN4.1 U1.14
IO13: H1.7 H2.18 U1.16
IO14: H1.8 H2.12 U1.13
IO15: H3.11 KEYMID7.1 U1.23
IO16: H1.6 H3.4 U1.27
IO17: H1.5 H3.5 U1.28
IO18: H1.3 H3.7 U1.30
IO19: H3.8 KEYL1.1 U1.31
IO21: H3.15 U1.33
IO22/I2C_SDA: H3.17 R8.2 U1.36 U4.3
IO23/I2C_SCL: H3.16 R7.2 U1.37 U4.4
IO25: H2.9 LED16.4 U1.10
IO26: H2.10 LED10.4 U1.11
IO27: H2.11 KEYR3.1 U1.12
IO32: H2.7 U1.8
IO33: H2.8 U1.9
IO34: H2.5 U1.6
IO35: H2.6 U1.7
RTS: Q3.2 R5.2 U2.6
S_VN: H2.4 U1.5
S_VP: H2.3 U1.4
SD0: H3.9 U1.21
SD1: H3.10 U1.22
SD2: H2.17 U1.17
SD3: H2.16 U1.18
U0RXD: H3.14 U1.34 U2.8
U0TXD: H3.13 U1.35 U2.9
$1N3522: Q3.1 R4.1
$1N3523: Q4.1 R5.1
$1N6190: LED4.4 LED5.2
$1N6194: LED3.4 LED4.2
$1N7224: LED2.4 LED3.2
$1N7332: LED6.4 LED7.2
$1N7339: LED7.4 LED8.2
$1N7349: LED8.4 LED9.2
$1N7358: LED9.4 LED10.2
$1N7583: C6.2 R6.2
$1N8343: C7.2 U2.10
$1N10626: LED2.2 LED11.4
$1N10653: LED1.1 R1.1
$1N11613: LED14.4 LED15.2
$1N11617: LED15.4 LED16.2
$1N11658: LED13.4 LED14.2
$1N11662: LED12.4 LED13.2

Pads without a net: LED6 2; LED11 2; LED12 2; U1 32; U2 5; U4 2 5; USB1 4

## Via types
v1: diameter 0.61, hole 0.305, Top Layer to Bottom Layer, 139 vias

## Routing (per net, layer and track width the routed paths; a pad name or vN(x,y) marks a point on that pad's centre or on a via; arc(x,y) is an arc through that point)
3V3: length 165.3
  Top Layer w0.305: U4.1 11.12,46.87 11.38,46.61 11.38,45.85 10.94,45.4 C8.2
  Top Layer w0.508: R6.1 36.34,34.72 35.44,34.72 ; 18.65,56.5 18.25,56.5 16.09,58.66 14.67,58.66 11.51,55.5 5.67,55.5 3.74,53.58 3.74,40.14 ; 3.74,40.14 4.5,40.91 5.52,40.91 5.99,41.38 6.03,41.38 v1(7.06,42.42) ; 3.74,40.14 3.74,16.24 4.48,15.51 5.5,15.51 6.26,14.74 6.26,12.73 C5.2 ; R7.1 v1(10.67,42.4) R8.1 ; C4.2 14.49,8.19 16.06,6.62 R1.2 17.99,2.29 19.13,1.14 42.12,1.14 45,4.03 H2.1 44.75,6.35 42.88,6.35 41.88,5.35 R9.2 ; 35.44,34.72 35,34.29 35,32.64 24.34,21.97 v1(23.96,21.97) ; 35.44,34.72 U1.2 ; v1(17.99,17.4) 15.19,17.4 14.05,18.54 11.71,18.54 U3.4 ; C8.2 11.66,44.58 v1(12.02,44.22) v1(12.02,43.57)
  Bottom Layer w0.508: v1(12.02,43.57) 10.87,42.42 v1(7.06,42.42) ; v1(17.99,17.4) 22.56,21.97 v1(23.96,21.97)
GND:
  vias: v1(5.16,95.5) v1(5.16,88.01) v1(5.16,80.52) v1(5.16,73.03) v1(5.16,65.53) v1(5.16,58.04) v1(7.65,53.09) v1(8.46,28.19) v1(8.84,35.94) v1(9.35,45.85) v1(9.86,23.88) v1(10.24,58.04) v1(10.49,53.09) v1(11.38,33.66) v1(13.16,26.8) v1(16.6,96.39) v1(16.6,92.74) v1(16.6,89.09) v1(16.6,85.44) v1(16.6,81.79) v1(16.6,78.14) v1(16.6,74.49) v1(16.6,70.83) v1(16.6,67.18) v1(19.64,16.76) v1(20.39,96.39) v1(20.39,92.74) v1(20.39,89.09) v1(20.39,85.44) v1(20.39,81.79) v1(20.39,78.14) v1(20.39,74.49) v1(20.39,70.83) v1(20.39,67.18) v1(23.19,37.47) v1(24.08,36.58) v1(25.06,37.47) v1(26.01,36.58) v1(26.9,37.44) v1(26.88,22.1) v1(28.76,21.38) v1(30.05,33.53) v1(30.31,18.29) v1(30.31,15.75) v1(30.43,96.39) v1(30.43,92.74) v1(30.43,89.09) v1(30.43,85.44) v1(30.43,81.79) v1(30.43,78.14) v1(30.43,74.49) v1(30.43,70.83) v1(30.43,67.18) v1(30.74,5.46) v1(30.74,3.3) v1(31.19,33.53) v1(32.15,18.16) v1(32.34,7.62) v1(32.36,5.46) v1(32.36,3.3) v1(33.73,23.62) v1(33.73,21.34) v1(34.23,96.39) v1(34.23,92.74) v1(34.23,89.09) v1(34.23,85.44) v1(34.23,81.79) v1(34.23,78.14) v1(34.23,74.49) v1(34.23,70.83) v1(34.23,67.18) v1(34.75,28.19) v1(36.02,54.99) v1(36.15,26.67) v1(36.15,23.62) v1(36.15,21.34) v1(38.69,17.27) v1(40.34,54.1) v1(40.85,3.3) v1(43.13,60.99) v1(43.13,58.55) v1(45.04,96.39) v1(45.04,88.9) v1(45.04,81.41) v1(45.04,73.91) v1(45.04,66.42)
VCC: length 259.6
  Top Layer w0.508: 42.07,81.26 40.94,81.26 LED14.1 ; 42.07,81.26 42.52,80.81 42.52,74.14 41.76,73.38 ; 42.07,81.26 42.52,81.71 42.52,88.88 41.68,89.72 ; 13.96,89.39 12.98,89.39 LED7.1 ; 13.96,89.39 14.2,89.39 14.56,89.03 14.56,82.71 13.4,81.55 ; 13.96,89.39 14.68,90.11 14.68,96.77 13.57,97.89 LED6.1 ; 27.79,81.26 28.53,80.52 28.53,74.25 27.66,73.38 ; 27.79,81.26 26.94,81.26 LED3.1 ; 27.79,81.26 28.53,82 28.53,89.03 27.66,89.89 ; LED12.1 40.87,97.66 42.14,97.66 42.5,97.3 42.5,90.54 41.68,89.72 ; 41.68,89.72 LED13.1 ; 29.48,65.22 28.65,66.04 28.65,72.39 27.66,73.38 ; 29.48,65.22 26.65,65.22 ; 29.48,65.22 v1(30.05,64.64) ; 27.66,73.38 LED4.1 ; 27.66,89.89 26.83,89.89 LED2.1 ; 27.66,89.89 28.4,90.63 28.4,96.65 27.16,97.89 LED11.1 ; H2.19 45,51.91 ; 41.76,73.38 42.56,72.58 42.56,65.72 42.05,65.22 40.65,65.22 ; 41.76,73.38 LED15.1 ; 13.4,81.55 LED8.1 ; 13.4,81.55 14.56,80.39 14.56,74.5 13.44,73.38 ; 13.44,73.38 LED9.1 ; 13.44,73.38 14.56,72.26 v1(14.56,64.39) 13.73,65.22 12.65,65.22 ; v1(27.24,20.14) 27.24,17.81
  Top Layer w0.762: v1(30.86,36) 22.68,27.81 v1(22.3,27.81) ; 42.05,65.22 42.18,65.22 45,62.39 H2.19 ; 45,51.91 v1(40.08,46.99) v1(40.08,46.15)
  Bottom Layer w0.508: v1(27.24,20.14) 27.24,20.21 v1(26.62,20.83) 23.57,20.83 21.03,18.28 21.03,13.58 17.99,10.55 15.7,10.55 14.84,9.69 ; v1(14.84,9.27) 14.84,9.69 ; 14.84,9.69 14.84,10.01 v1(14.82,10.03) 14.82,10.63 v1(14.99,10.79) v1(14.05,10.79) 14.05,10.41 v1(13.67,10.03) v1(13.67,9.27)
  Bottom Layer w0.762: v1(14.56,64.39) 14.56,63.25 15.06,62.74 28.15,62.74 v1(30.05,64.64) 32.68,64.64 H2.19 ; v1(40.08,46.15) 40.08,45.2 v1(31.33,36.45) 30.88,36 v1(30.86,36) ; v1(14.99,10.79) 14.99,20.5 v1(22.3,27.81)
CLK: length 22.1
  Top Layer w0.203: 23.7,51.38 v1(23.7,49.28)
  Bottom Layer w0.203: H3.19 6.07,51.26 21.31,51.26 23.29,49.28 v1(23.7,49.28)
CMD: length 30.2
  Top Layer w0.203: U1.19 v1(24.97,49.66)
  Bottom Layer w0.203: v1(24.97,49.66) 26.39,48.23 29.37,48.23 30.23,49.09 30.23,50.03 30.81,50.61 40.77,50.61 42.85,48.53 42.85,43.71 44.4,42.16 H2.15
D+: length 7.9
  Top Layer w0.254: v1(24.21,8.89) 24.21,13.15 U2.1 ; v1(25.1,7.11) 25.1,5.77 USB1.3
  Bottom Layer w0.254: v1(24.21,8.89) 24.21,8.64 25.1,7.75 v1(25.1,7.11)
D-: length 7.9
  Top Layer w0.254: USB1.2 24.35,7.51 25.24,8.4 U2.2
DTR: length 10.3
  Top Layer w0.203: U2.4 27.26,13.16 27.26,11.43 27.4,11.29 32.45,11.29 32.85,11.69 R4.2 35.33,11.69 Q4.2
EN: length 61.7
  Top Layer w0.203: 37.18,20.84 34.6,18.26 34.6,16.41 34.77,16.24 36.42,16.24 36.66,16 Q3.3 ; 37.18,20.84 40.59,24.26 40.59,25.15 37.67,28.07 37.67,35.43 37.11,35.99 33.04,35.99 ; 37.18,20.84 41.99,16.03 41.99,10.67 43.51,9.14 H2.2 43.21,7.35 R9.1 40.67,7.05 C9.2
  Bottom Layer w0.203: RST1.1 39.32,5.6 39.32,6.73 41.74,9.14 H2.2
IO0: length 90.1
  Top Layer w0.203: v1(17.63,49.68) 17.35,49.96 U1.25 ; v1(39.45,16.13) 39.45,14.37 Q4.3
  Bottom Layer w0.203: 31.32,22.48 31.32,20.57 35.77,16.13 v1(39.45,16.13) ; 21.9,29.18 21.9,45.01 17.63,49.28 v1(17.63,49.68) ; 21.9,29.18 8.59,15.88 8.59,13.71 5,10.12 H3.2 6.81,9.14 8.97,6.99 8.97,5.59 9.11,5.44 10.8,5.44 IO0.1 ; 21.9,29.18 23.47,29.18 24.84,27.81 24.84,25.27 25.73,24.38 30.43,24.38 31.32,23.5 31.32,22.63
IO2: length 46.3
  Top Layer w0.203: H3.12 8.33,34.54 11.51,31.37 17.02,31.37 19.05,33.4 19.05,48.97 v1(18.62,49.4) U1.24
  Bottom Layer w0.203: KEYUP2.1 27.13,43.87 27.13,45.72 26.11,46.74 21.29,46.74 v1(18.62,49.4)
IO4: length 69.4
  Top Layer w0.203: LED5.4 26.5,60.36 26.5,59.69 25.86,59.06 v1(24.59,59.06) ; v1(15.83,52.32) 14.88,52.32 13.97,51.42 13.97,49.1 14.38,48.69 15.64,48.69 15.76,48.57 v1(17.48,48.57)
  Bottom Layer w0.203: v1(17.48,48.57) 17.48,48.28 21.49,44.27 21.49,29.35 7.95,15.81 7.95,14.64 H3.3 ; v1(15.83,52.32) 16.84,52.32 19.85,55.34 19.85,57.24 21.67,59.06 v1(24.59,59.06)
IO5: length 60.2
  Top Layer w0.203: 23.73,56.5 21.23,54 13.94,54 12.75,52.81 12.75,46.26 14.13,44.88 U1.29 v1(17.48,44.88)
  Bottom Layer w0.203: v1(17.48,44.88) 17.48,44.47 20.27,41.68 20.27,29.86 9.72,19.3 H3.6
IO12: length 52.6
  Top Layer w0.203: v1(31.19,49.91) 32.98,49.91 U1.14
  Bottom Layer w0.203: KEYDOWN4.1 28.27,25.53 29.17,26.42 29.16,26.42 29.16,46.61 31.19,48.64 v1(31.19,49.91) 40.66,49.91 42.4,48.17 42.4,39.69 H2.13
IO13: length 26.4
  Top Layer w0.203: v1(28.78,49.66) U1.16 28.78,53.09 31.35,55.66 31.35,56.5
  Bottom Layer w0.203: v1(28.78,49.66) 28.78,50.55 30.07,51.83 42.95,51.83 H2.18
IO14: length 30.1
  Top Layer w0.203: 34.42,48.69 36.61,46.51 38.73,46.51 41.46,43.78 41.46,38.09 H2.12 ; 34.42,48.69 33.04,48.69 ; 34.42,48.69 35.51,49.78 35.51,52.2 33.89,53.82 33.89,56.5
IO15: length 55.5
  Top Layer w0.203: U1.23 19.89,49.5 v1(19.85,49.47) 19.85,49.18 19.46,48.78 19.46,33.23 17.19,30.96 6.04,30.96 H3.11
  Bottom Layer w0.203: v1(19.85,49.47) 22.18,47.14 26.28,47.14 28.53,44.9 28.53,37.34 27.19,36 KEYMID7.1
IO16: length 68
  Top Layer w0.203: v1(17.48,47.42) U1.27 13.87,47.42 13.56,47.73 13.56,52.47 14.18,53.09 26.37,53.09 28.81,55.53 28.81,56.42
  Bottom Layer w0.203: H3.4 5.79,14.22 21.08,29.52 21.08,43.41 17.48,47.02 v1(17.48,47.42)
IO17: length 64.4
  Top Layer w0.203: 26.27,56.5 26.27,55.66 24.21,53.59 14.11,53.59 13.16,52.64 13.16,46.87 13.87,46.15 U1.28 v1(17.48,46.15)
  Bottom Layer w0.203: v1(17.48,46.15) 17.48,45.75 20.68,42.55 20.68,29.69 7.75,16.76 H3.5
IO18: length 56.4
  Top Layer w0.203: H1.3 19.56,54.41 13.77,54.41 12.34,52.98 12.34,46.03 13.82,44.55 13.82,43.81 14.02,43.61 U1.30 v1(17.48,43.61)
  Bottom Layer w0.203: H3.7 11.68,21.84 19.86,30.02 19.86,41.2 17.48,43.59 v1(17.48,43.61)
IO19: length 28.8
  Top Layer w0.203: U1.31 v1(17.86,42.34)
  Bottom Layer w0.203: v1(17.86,42.34) 19.46,40.75 19.46,35.45 18.68,34.67 KEYL1.1 6.9,24.38 H3.8
IO21: length 15.8
  Top Layer w0.203: U1.33 v1(17.73,39.8)
  Bottom Layer w0.203: H3.15 7.36,39.8 v1(17.73,39.8)
IO22/I2C_SDA: length 25.2
  Top Layer w0.203: 11.74,47.87 U4.3 ; 11.74,47.87 11.74,48.56 11.53,48.77 6.52,48.77 H3.17 ; 11.74,47.87 11.94,47.67 11.94,45.86 13.41,44.38 13.41,41.78 13.16,41.53 12.27,41.53 12.02,41.28 R8.2 12.02,38.23 14.25,35.99 15.64,35.99
IO23/I2C_SCL: length 21.9
  Top Layer w0.203: 7.95,44.74 7.95,41.81 8.36,41.4 9.04,41.4 9.24,41.2 9.24,40.54 9.35,40.43 9.35,38.38 13.03,34.7 15.58,34.7 15.64,34.75 ; 7.95,44.74 5.04,44.74 H3.16 ; 7.95,44.74 7.95,47.53 8.33,47.9 8.81,47.9
IO25: length 43.3
  Top Layer w0.203: H2.9 40.64,31.28 40.64,43.13 38.89,44.88 v1(37.4,44.88) U1.10 ; v1(38.56,47.88) 38.56,57.15 40.65,59.24 LED16.4
  Bottom Layer w0.203: v1(37.4,44.88) 37.4,45.64 38.05,46.29 38.05,46.36 38.56,46.86 v1(38.56,47.88)
IO26: length 63.2
  Top Layer w0.203: H2.10 44.28,29.46 41.05,32.69 41.05,43.61 38.56,46.1 v1(35.44,46.1) 33.09,46.1 U1.11 ; LED10.4 13.22,61.09 15.19,61.09 18.05,58.23 36.21,58.23 36.83,57.61 v1(36.83,47.88)
  Bottom Layer w0.203: v1(36.83,47.88) 36.83,47.5 v1(35.44,46.1)
IO27: length 41
  Top Layer w0.203: U1.12 30.81,47.42
  Bottom Layer w0.203: v1(30.83,47.41) 33.9,47.41 35.89,49.4 40.59,49.4 41.99,48.01 41.99,35.02 H2.11 40.97,32 38.31,34.67 KEYR3.1
IO32: length 28.8
  Top Layer w0.203: H2.7 44.4,21.84 43.39,22.86 43.39,25.47 39.83,29.02 39.83,40.64 38.13,42.34 U1.8
IO33: length 27.5
  Top Layer w0.203: H2.8 45,24.68 40.24,29.44 40.24,42.01 38.63,43.61 U1.9
IO34: length 30.5
  Top Layer w0.203: U1.6 37.24,39.8 38.94,38.1 38.94,28.76 42.47,25.23 42.47,19.27 44.98,16.76 H2.5
IO35: length 29.7
  Top Layer w0.203: H2.6 44.43,19.3 43.03,20.7 42.99,20.7 42.88,20.81 42.88,25.4 39.35,28.93 39.35,39.22 37.8,40.77 33.34,40.77 33.04,41.07
RTS: length 9.3
  Top Layer w0.203: Q3.2 35.33,15.25 R5.2 33.58,15.22 32.35,15.22 30.81,16.76 28.65,16.76 28.24,17.18 U2.6
S_VN: length 31.9
  Top Layer w0.203: U1.5 37.49,38.53 38.43,37.59 38.43,28.57 41.86,25.15 41.86,19.3 43.39,17.78 43.39,15.84 H2.4
S_VP: length 33.6
  Top Layer w0.152: H2.3 44.28,11.68 42.86,13.1 42.86,17.76 41.48,19.15 41.48,24.99 38.05,28.42 38.05,36.7 37.49,37.26 U1.4
SD0: length 37.1
  Top Layer w0.203: H3.9 8.23,30.15 17.53,30.15 20.27,32.89 20.27,47.75 22.43,49.91 U1.21
SD1: length 35.2
  Top Layer w0.203: H3.10 6.09,30.56 17.36,30.56 19.87,33.06 19.87,48.62 21.16,49.91 U1.22
SD2: length 23
  Top Layer w0.203: U1.17 v1(27.51,49.66)
  Bottom Layer w0.203: H2.17 45,47.53 41.11,51.43 30.24,51.43 29.42,50.61 29.42,49.43 29.03,49.05 28.12,49.05 v1(27.51,49.66)
SD3: length 26.5
  Top Layer w0.203: U1.18 v1(26.24,49.66)
  Bottom Layer w0.203: v1(26.24,49.66) 27.26,48.64 29.2,48.64 29.82,49.26 29.82,50.44 30.4,51.02 40.94,51.02 43.26,48.7 43.26,46.44 H2.16
U0RXD: length 42.4
  Top Layer w0.203: U1.34 v1(17.73,38.53) 18.37,37.9 18.37,33.89 v1(18.34,33.87) ; v1(17.83,29.03) 17.91,29.03 20.78,26.16 20.78,20.52 20.98,20.32 25.61,20.32 26.24,19.69 U2.8
  Bottom Layer w0.203: v1(18.34,33.87) 18.34,32.42 17.63,31.71 17.63,29.24 v1(17.83,29.03) ; v1(17.73,38.53) 6.09,38.53 H3.14
U0TXD: length 41.3
  Top Layer w0.203: v1(17.54,33.34) 17.73,33.53 17.73,37.59 v1(17.67,37.66) 17.28,37.26 U1.35 ; U2.9 25.22,18.33 25.22,19.56 24.87,19.91 20.81,19.91 20.37,20.35 20.37,25.04 16.59,28.83 v1(16.46,28.83)
  Bottom Layer w0.203: v1(17.54,33.34) 17.54,32.19 17.22,31.88 17.22,29.21 16.84,28.83 v1(16.46,28.83) ; v1(17.67,37.66) 5.57,37.66 H3.13
$1N3522: length 10.9
  Top Layer w0.203: Q3.1 37.98,16.95 38.69,16.25 38.69,15.15 36.24,12.7 34.11,12.7 R4.1
$1N3523: length 6
  Top Layer w0.203: R5.1 34.66,15.71 36.28,15.71 36.66,15.33 36.66,14.77 35.53,13.65 Q4.1
$1N6190: length 6.5
  Top Layer w0.254: 26.62,68.66 26.62,67.04 26.42,66.84 23.5,66.84 23.32,66.66 23.32,65.2
$1N6194: length 6.5
  Top Layer w0.254: 26.62,76.79 26.62,75.17 26.42,74.96 23.5,74.96 23.32,74.78 23.32,73.32
$1N7224: length 6.6
  Top Layer w0.254: 23.32,81.45 23.32,82.88 23.63,83.19 26.5,83.19 26.75,83.44 26.75,84.79 26.62,84.92
$1N7332: length 6.5
  Top Layer w0.254: LED7.2 9.35,91.06 9.53,91.24 12.45,91.24 12.65,91.44 12.65,93.18 LED6.4
$1N7339: length 6.5
  Top Layer w0.254: LED8.2 9.35,83.06 9.53,83.24 12.45,83.24 12.65,83.44 12.65,85.02 LED7.4
$1N7349: length 6.5
  Top Layer w0.254: LED8.4 12.65,76.85 12.65,75.31 12.45,75.11 9.53,75.11 9.35,74.93 LED9.2
$1N7358: length 6.5
  Top Layer w0.254: LED9.4 12.65,68.68 12.65,67.06 12.45,66.85 9.53,66.85 9.35,66.67 9.35,65.22
$1N7583: length 1.8
  Top Layer w0.203: C6.2 R6.2
$1N8343: length 4.8
  Top Layer w0.203: 22.56,14.67 23.13,15.24 23.96,15.24 24.24,15.53 U2.10
$1N10626: length 6.5
  Top Layer w0.254: 26.62,93.17 26.62,91.55 26.42,91.35 23.5,91.35 23.32,91.17 23.32,89.71
$1N10653: length 3.4
  Top Layer w0.305: R1.1 LED1.1
$1N11613: length 6.5
  Top Layer w0.254: 40.72,76.92 40.72,75.29 40.52,75.09 37.6,75.09 37.42,74.91 37.42,73.45
$1N11617: length 6.7
  Top Layer w0.254: 37.42,65.2 37.29,65.32 37.29,66.53 37.6,66.84 40.52,66.84 40.72,67.04 40.72,68.66
$1N11658: length 6.5
  Top Layer w0.254: 37.42,81.58 37.42,83.04 37.6,83.22 40.52,83.22 40.72,83.42 40.72,85.05
$1N11662: length 6.5
  Top Layer w0.254: 40.72,93.17 40.72,91.55 40.52,91.35 37.6,91.35 37.42,91.17 37.42,89.71

## Copper pours and planes (outline as drawn; the poured copper is in the pictures)
3V3 on Top Layer: 11,9.14 12.04,9.14 12.61,8.57 12.61,7.8 11.07,7.8 10.75,8.13 10.49,8.13 10.49,8.64
3V3 on Top Layer: 11.13,13.72 11.13,16.13 9.86,17.4 13.29,17.4 13.41,17.53 13.41,14.86 12.27,13.72
3V3 on Top Layer: 11.25,11.43 9.86,10.03 9.86,9.02 11.12,9.02 12.14,10.04 12.14,11.43
+5V on Top Layer: 19.64,10.54 20.61,10.54 23.91,7.42 23.91,6.15 23.49,5.67 21.28,7.89 19.51,9.02 19.51,10.41
GND on Top Layer: -5.64,102.62 56.97,102.62 56.97,-3.81 -5.64,-3.81
GND on Bottom Layer: -1.95,103.12 55.2,103.12 55.2,-1.4 -1.95,-1.4
VCC on Top Layer: 15.83,13.97 15.67,14.12 14.51,14.12 14.05,13.67 14.05,12.57 14.18,12.45 15.35,12.45 16.21,13.3 15.83,13.69
VCC on Top Layer: 16.21,10.54 16.21,10.67 17.73,12.19 17.73,12.83 17.85,12.95 19,12.95 19,11.59 17.91,10.5 17.48,10.37 16.38,10.37
VCC on Top Layer: 13.41,11.3 13.41,10.74 12.75,10.07 12.75,9.18 13.13,8.79 15.41,8.79 15.41,10.38 15.95,10.92 15.37,11.51 13.62,11.51
VCC on Top Layer: 17.73,12.7 16.74,12.7 16.21,13.22 16.21,14.06 17.78,14.06 17.78,12.75

Small or netless copper shapes (teardrops, artwork), in the pictures only: 223 on Top Layer, 80 on Bottom Layer

## Text on the board
Bottom Silkscreen Layer: EN | VCC | SD2 | SD3 | CMD | GND | 3V3 | IO13 | IO12 | IO14 | IO27 | IO26 | IO25 | IO33 | IO32 | IO35 | IO34 | S_VN | S_VP | CLK | IO22 | IO23 | IO21 | RXD | TXD | IO2 | IO15 | SD1 | SD0 | IO19 | IO18 | IO5 | IO17 | IO16 | IO4 | IO0
